# Altium schematic sheet Jumper SCH.schdoc
size 44 x 27 mm
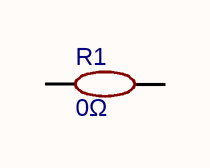
[diagram p0: Jumper SCH.schdoc]

## Parts
R1  0Ω  [R0402]

## Nets

Not connected (* = marked no-connect by the designer): R1 1 2

## Library data of the parts
R1 = 0Ω: RES 0 OHM JUMPER 1/16W 0402; Manufacturer: YAGEO(国巨); Manufacturer Part: RC0402FR-070RL; nameAlias: Value; Supplier: LCSC; Supplier Part: C106231; JLCPCB Part Class: Extended Part; spicePre: R; spiceSymbolName: RC0402FR-070RL; LCSC part Number: C106231